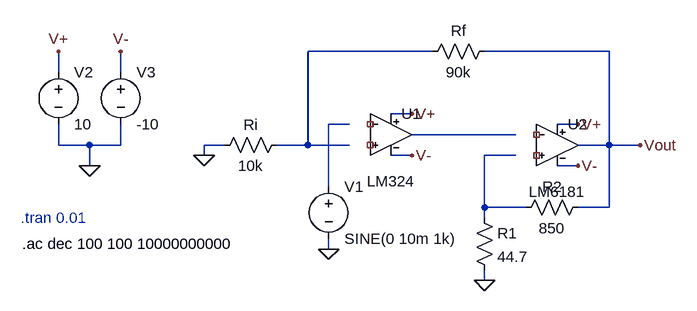
[diagram p0: schematic VFA_CFA.asc]
VFA_CFA.asc, the LTspice schematic file:
Version 4
SHEET 1 880 680
WIRE -176 16 -368 16
WIRE 96 16 -96 16
WIRE -752 48 -752 16
WIRE -656 48 -656 16
WIRE -208 112 -240 112
WIRE -304 128 -336 128
WIRE 48 128 16 128
WIRE -48 144 -208 144
WIRE -752 160 -752 128
WIRE -704 160 -752 160
WIRE -656 160 -656 128
WIRE -656 160 -704 160
WIRE -496 160 -528 160
WIRE -368 160 -368 16
WIRE -368 160 -416 160
WIRE -304 160 -368 160
WIRE 96 160 96 16
WIRE 96 160 48 160
WIRE 144 160 96 160
WIRE -528 176 -528 160
WIRE -208 176 -240 176
WIRE -48 176 -96 176
WIRE -704 192 -704 160
WIRE 48 192 16 192
WIRE -336 224 -336 128
WIRE -96 256 -96 176
WIRE -32 256 -96 256
WIRE 96 256 96 160
WIRE 96 256 48 256
WIRE -96 272 -96 256
WIRE -336 320 -336 304
WIRE -96 368 -96 352
FLAG -528 176 0
FLAG -336 320 0
FLAG -96 368 0
FLAG 144 160 Vout
FLAG -208 112 V+
FLAG 48 128 V+
FLAG -208 176 V-
FLAG 48 192 V-
FLAG -704 192 0
FLAG -656 16 V-
FLAG -752 16 V+
SYMBOL AutoGenerated\\LM324 -240 144 R0
SYMATTR InstName U1
SYMBOL res -112 256 R0
SYMATTR InstName R1
SYMATTR Value 44.7
SYMBOL res 64 240 R90
WINDOW 0 0 56 VBottom 2
WINDOW 3 32 56 VTop 2
SYMATTR InstName R2
SYMATTR Value 850
SYMBOL res -80 0 R90
WINDOW 0 0 56 VBottom 2
WINDOW 3 32 56 VTop 2
SYMATTR InstName Rf
SYMATTR Value 90k
SYMBOL res -400 144 R90
WINDOW 0 0 56 VBottom 2
WINDOW 3 32 56 VTop 2
SYMATTR InstName Ri
SYMATTR Value 10k
SYMBOL voltage -336 208 R0
WINDOW 39 0 0 Left 0
SYMATTR Value2 AC 1 0
SYMATTR InstName V1
SYMATTR Value SINE(0 10m 1k)
SYMBOL voltage -752 32 R0
WINDOW 123 0 0 Left 0
WINDOW 39 0 0 Left 0
SYMATTR InstName V2
SYMATTR Value 10
SYMBOL voltage -656 32 R0
WINDOW 123 0 0 Left 0
WINDOW 39 0 0 Left 0
SYMATTR InstName V3
SYMATTR Value -10
SYMBOL AutoGenerated\\LM6181 16 160 R0
SYMATTR InstName U2
TEXT -808 312 Left 2 !.ac dec 100 100 10000000000
TEXT -810 272 Left 2 ;.tran 0.01

The netlist it stands for:
* VFA_CFA.asc
XU1 NC_01 NC_02 V+ V- N003 LM324  ; pins In+ In- V+ V- OUT
R1 N004 0 44.7
R2 Vout N004 850
Rf Vout N001 90k
Ri N001 0 10k
V1 N002 0 SINE(0 10m 1k) AC 1 0
V2 V+ 0 10
V3 V- 0 -10
XU2 NC_03 NC_04 V+ V- Vout LM6181  ; pins In+ In- V+ V- OUT
.ac dec 100 100 10000000000
* .tran 0.01
.lib E:\LtSpice_components\LM324.ti.lib
.lib E:\LtSpice_components\LM6181.lib
.backanno
.end